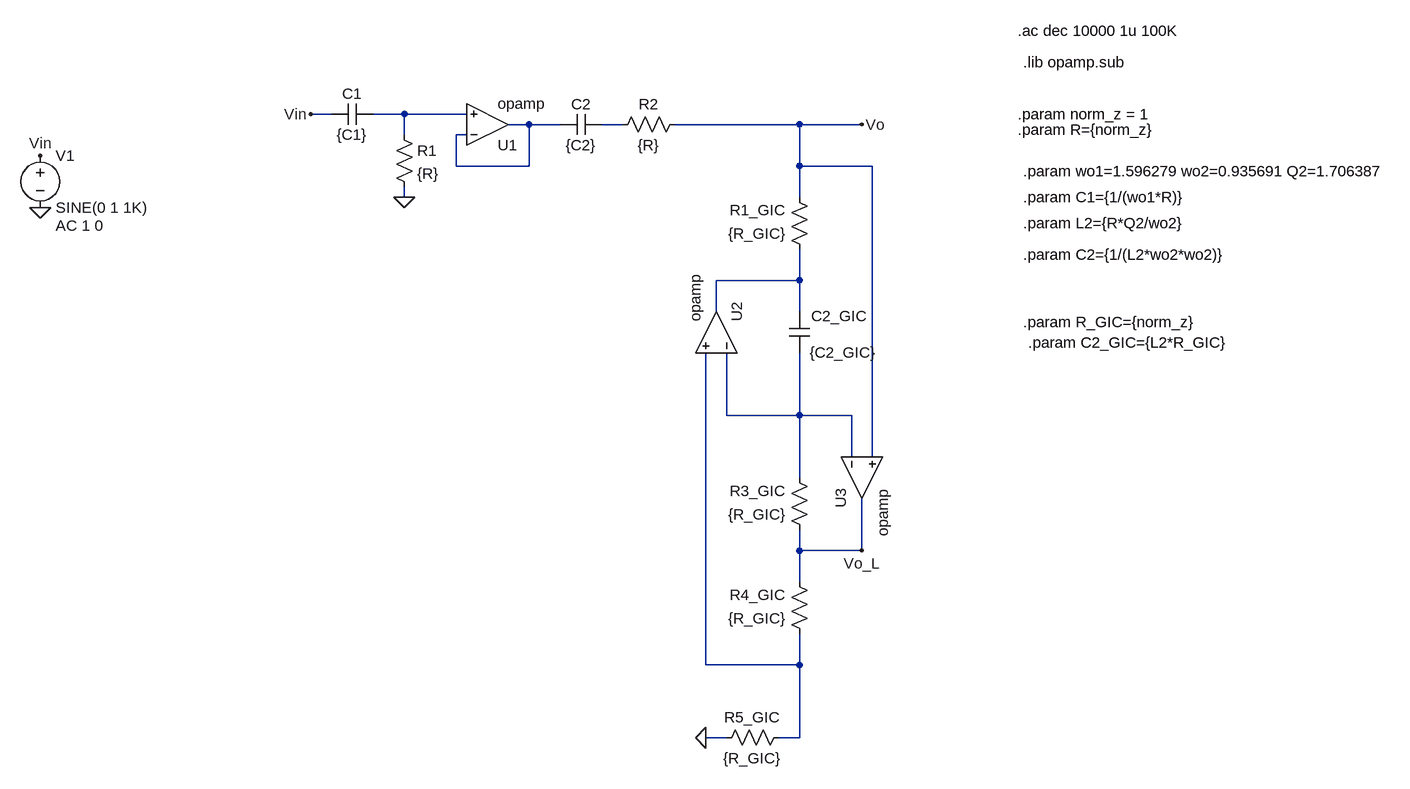
[diagram p0: schematic HPF_normalizado_con_GIC.asc]
HPF_normalizado_con_GIC.asc, the LTspice schematic file:
Version 4.1
SHEET 1 2160 1120
WIRE 80 112 48 112
WIRE 192 112 144 112
WIRE 288 112 192 112
WIRE 384 128 352 128
WIRE 432 128 384 128
WIRE 528 128 496 128
WIRE 800 128 608 128
WIRE 896 128 800 128
WIRE 192 144 192 112
WIRE 288 144 272 144
WIRE 272 192 272 144
WIRE 384 192 384 128
WIRE 384 192 272 192
WIRE 800 192 800 128
WIRE 912 192 800 192
WIRE 192 240 192 224
WIRE 800 240 800 192
WIRE 800 368 800 320
WIRE 800 368 672 368
WIRE 672 416 672 368
WIRE 800 416 800 368
WIRE 688 576 688 480
WIRE 800 576 800 480
WIRE 800 576 688 576
WIRE 880 576 800 576
WIRE 880 640 880 576
WIRE 912 640 912 192
WIRE 800 672 800 576
WIRE 800 784 800 752
WIRE 896 784 896 704
WIRE 896 784 800 784
WIRE 800 832 800 784
WIRE 656 960 656 480
WIRE 800 960 800 912
WIRE 800 960 656 960
WIRE 688 1072 656 1072
WIRE 800 1072 800 960
WIRE 800 1072 768 1072
FLAG 192 240 0
FLAG 48 112 Vin
FLAG -368 256 0
FLAG -368 176 Vin
FLAG 656 1072 0
FLAG 896 784 Vo_L
FLAG 896 128 Vo
SYMBOL res 176 128 R0
SYMATTR InstName R1
SYMATTR Value {R}
SYMBOL cap 144 96 R90
WINDOW 0 0 32 VBottom 2
WINDOW 3 32 32 VTop 2
SYMATTR InstName C1
SYMATTR Value {C1}
SYMBOL OpAmps\\opamp 320 192 M180
SYMATTR InstName U1
SYMBOL cap 496 112 R90
WINDOW 0 0 32 VBottom 2
WINDOW 3 32 32 VTop 2
SYMATTR InstName C2
SYMATTR Value {C2}
SYMBOL res 624 112 R90
WINDOW 0 0 56 VBottom 2
WINDOW 3 32 56 VTop 2
SYMATTR InstName R2
SYMATTR Value {R}
SYMBOL voltage -368 160 R0
WINDOW 123 24 124 Left 2
WINDOW 39 0 0 Left 0
SYMATTR Value2 AC 1 0
SYMATTR InstName V1
SYMATTR Value SINE(0 1 1K)
SYMBOL res 816 336 R180
WINDOW 0 36 76 Left 2
WINDOW 3 36 40 Left 2
SYMATTR InstName R1_GIC
SYMATTR Value {R_GIC}
SYMBOL cap 816 480 R180
WINDOW 0 -89 57 Left 2
WINDOW 3 -103 1 Left 2
SYMATTR InstName C2_GIC
SYMATTR Value {C2_GIC}
SYMBOL OpAmps\\opamp 736 448 M270
SYMATTR InstName U2
SYMBOL OpAmps\\opamp 832 672 M90
SYMATTR InstName U3
SYMBOL res 816 768 R180
WINDOW 0 36 76 Left 2
WINDOW 3 36 40 Left 2
SYMATTR InstName R3_GIC
SYMATTR Value {R_GIC}
SYMBOL res 816 928 R180
WINDOW 0 36 76 Left 2
WINDOW 3 36 40 Left 2
SYMATTR InstName R4_GIC
SYMATTR Value {R_GIC}
SYMBOL res 784 1056 R90
WINDOW 0 0 56 VBottom 2
WINDOW 3 32 56 VTop 2
SYMATTR InstName R5_GIC
SYMATTR Value {R_GIC}
TEXT 1136 -16 Left 2 !.ac dec 10000 1u 100K
TEXT 1144 32 Left 2 !.lib opamp.sub
TEXT 1136 112 Left 2 !.param norm_z = 1
TEXT 1136 136 Left 2 !.param R={norm_z}
TEXT 1144 200 Left 2 !.param wo1=1.596279 wo2=0.935691 Q2=1.706387
TEXT 1144 240 Left 2 !.param C1={1/(wo1*R)}
TEXT 1144 280 Left 2 !.param L2={R*Q2/wo2}
TEXT 1144 328 Left 2 !.param C2={1/(L2*wo2*wo2)}
TEXT 1144 432 Left 2 !.param R_GIC={norm_z}
TEXT 1152 464 Left 2 !.param C2_GIC={L2*R_GIC}

The netlist it stands for:
* HPF_normalizado_con_GIC.asc
R1 N001 0 {R}
C1 N001 Vin {C1}
X§U1 N002 N001 N002 opamp Aol=100K GBW=10Meg  ; pins invin noninvin out
C2 N003 N002 {C2}
R2 Vo N003 {R}
V1 Vin 0 SINE(0 1 1K) AC 1 0
R1_GIC N004 Vo {R_GIC}
C2_GIC N005 N004 {C2_GIC}
X§U2 N005 N006 N004 opamp Aol=100K GBW=10Meg  ; pins invin noninvin out
X§U3 N005 Vo Vo_L opamp Aol=100K GBW=10Meg  ; pins invin noninvin out
R3_GIC Vo_L N005 {R_GIC}
R4_GIC N006 Vo_L {R_GIC}
R5_GIC N006 0 {R_GIC}
.ac dec 10000 1u 100K
.lib opamp.sub
.param norm_z = 1
.param R={norm_z}
.param wo1=1.596279 wo2=0.935691 Q2=1.706387
.param C1={1/(wo1*R)}
.param L2={R*Q2/wo2}
.param C2={1/(L2*wo2*wo2)}
.param R_GIC={norm_z}
.param C2_GIC={L2*R_GIC}
.backanno
.end